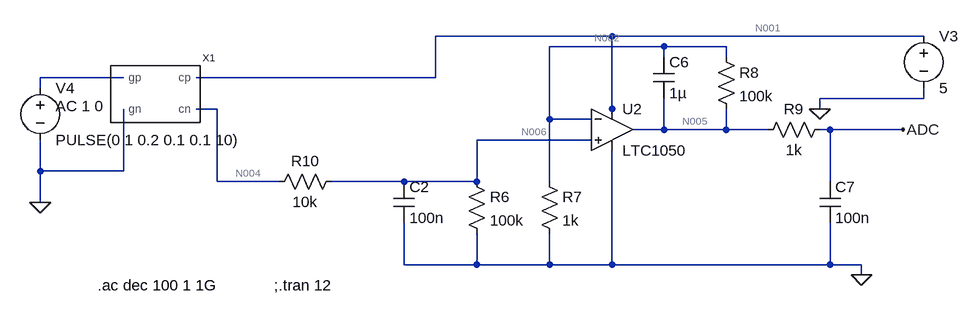
[diagram p0: schematic Draft1_NouvelleVersion.asc]
Draft1_NouvelleVersion.asc, the LTspice schematic file:
Version 4
SHEET 1 880 680
WIRE 272 -528 0 -528
WIRE 752 -528 272 -528
WIRE 352 -512 176 -512
WIRE 448 -512 352 -512
WIRE 352 -496 352 -512
WIRE 448 -496 448 -512
WIRE -480 -464 -608 -464
WIRE 0 -464 0 -528
WIRE 0 -464 -368 -464
WIRE -608 -448 -608 -464
WIRE 752 -432 752 -448
WIRE 752 -432 592 -432
WIRE -336 -416 -368 -416
WIRE 272 -416 272 -528
WIRE 592 -416 592 -432
WIRE 176 -400 176 -512
WIRE 240 -400 176 -400
WIRE 272 -400 272 -416
WIRE 352 -384 352 -432
WIRE 352 -384 304 -384
WIRE 448 -384 448 -416
WIRE 448 -384 352 -384
WIRE 512 -384 448 -384
WIRE 608 -384 592 -384
WIRE 720 -384 608 -384
WIRE 240 -368 64 -368
WIRE -608 -320 -608 -368
WIRE -480 -320 -480 -416
WIRE -480 -320 -608 -320
WIRE -336 -304 -336 -416
WIRE -240 -304 -336 -304
WIRE -48 -304 -160 -304
WIRE 64 -304 64 -368
WIRE 64 -304 -48 -304
WIRE 176 -304 176 -400
WIRE 608 -304 608 -384
WIRE -608 -272 -608 -320
WIRE -48 -176 -48 -240
WIRE 64 -176 64 -224
WIRE 64 -176 -48 -176
WIRE 176 -176 176 -224
WIRE 176 -176 64 -176
WIRE 272 -176 272 -352
WIRE 272 -176 176 -176
WIRE 608 -176 608 -240
WIRE 608 -176 272 -176
WIRE 656 -176 608 -176
WIRE 656 -160 656 -176
FLAG 656 -160 0
FLAG 592 -416 0
FLAG 720 -384 ADC
FLAG -608 -272 0
SYMBOL res 48 -320 R0
SYMATTR InstName R6
SYMATTR Value 100k
SYMBOL res 160 -320 R0
SYMATTR InstName R7
SYMATTR Value 1k
SYMBOL res 432 -512 R0
SYMATTR InstName R8
SYMATTR Value 100k
SYMBOL cap -64 -304 R0
SYMATTR InstName C2
SYMATTR Value 100n
SYMBOL cap 336 -496 R0
SYMATTR InstName C6
SYMATTR Value 1µ
SYMBOL cap 592 -304 R0
SYMATTR InstName C7
SYMATTR Value 100n
SYMBOL OpAmps\\LTC1050 272 -448 R0
SYMATTR InstName U2
SYMBOL res 608 -400 R90
WINDOW 0 0 56 VBottom 2
WINDOW 3 32 56 VTop 2
SYMATTR InstName R9
SYMATTR Value 1k
SYMBOL voltage 752 -544 R0
WINDOW 123 0 0 Left 0
WINDOW 39 0 0 Left 0
SYMATTR InstName V3
SYMATTR Value 5
SYMBOL res -144 -320 R90
WINDOW 0 0 56 VBottom 2
WINDOW 3 32 56 VTop 2
SYMATTR InstName R10
SYMATTR Value 10k
SYMBOL Projet2 -448 -432 R0
SYMATTR InstName X1
SYMBOL voltage -608 -464 R0
WINDOW 123 24 44 Left 2
WINDOW 39 0 0 Left 0
SYMATTR Value2 AC 1 0
SYMATTR InstName V4
SYMATTR Value PULSE(0 1 0.2 0.1 0.1 10)
TEXT -248 -144 Left 2 !;.tran 12
TEXT -520 -144 Left 2 !.ac dec 100 1 1G

The netlist it stands for:
* Draft1_NouvelleVersion.asc
R6 N006 0 100k
R7 N002 0 1k
R8 N002 N005 100k
C2 N006 0 100n
C6 N002 N005 1µ
C7 ADC 0 100n
XU2 N006 N002 N001 0 N005 LTC1050  ; pins In+ In- V+ V- OUT
R9 ADC N005 1k
V3 N001 0 5
R10 N006 N004 10k
XX1 N001 N004 N003 0 Projet2  ; pins cp cn gp gn
V4 N003 0 PULSE(0 1 0.2 0.1 0.1 10) AC 1 0
;.tran 12
.ac dec 100 1 1G
.lib LTC.lib
.backanno
.end

* Results of the author's LTspice run, read from the files saved beside the schematic
* Operating Point, zero values left out:
*   V(n006) = 4.995 mV
*   V(n002) = 4.995 mV
*   V(n005) = 504.4 mV
*   V(adc) = 504.4 mV
*   V(n001) = 5 V
*   V(n004) = 5.494 mV
*   I(R6) = 49.95 nA
*   I(R7) = 4.995 µA
*   I(R8) = -4.995 µA
*   I(R10) = -49.95 nA
*   I(V3) = -754.2 µA
*   Ix(u2:3) = 754.1 µA
*   Ix(u2:4) = -749.1 µA
*   Ix(u2:5) = -4.995 µA
*   Ix(x1:CP) = 49.95 nA
*   Ix(x1:CN) = -49.95 nA
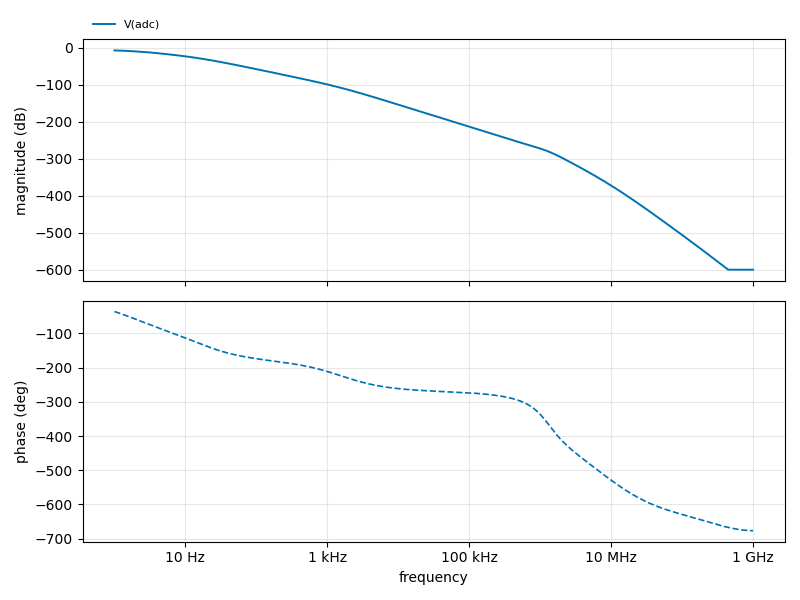
[diagram p1: AC Analysis of Draft1_NouvelleVersion.asc, plotted from the saved traces]
* AC Analysis, 1 run:
*   V(adc): -7.42 dB at 1 Hz, -600.00 dB at 1 GHz, peak -7.42 dB at 1 Hz, 3 dB below the peak at 2.107 Hz